# Altium schematic sheet USB.SchDoc
size A; SheetNumber: 2; SheetTotal: 6
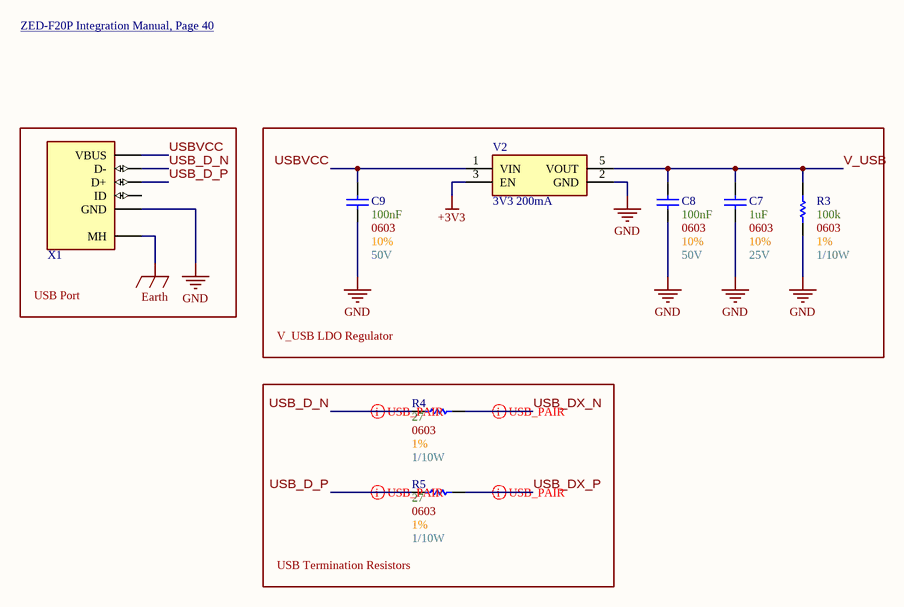
[diagram p0: USB.SchDoc]

## Parts
C7  Max Voltage: 25V  Size Package: 0603  Tolerance: 10%  Capacitance: 1uF  [[Cap] SMD 0603]  (hidden comment: [Cap] 0603 1uF 10% 25V)
C8  Max Voltage: 50V  Size Package: 0603  Tolerance: 10%  Capacitance: 100nF  [[Cap] SMD 0603]  (hidden comment: [Cap] 0603 0.1uF 10% 50V)
C9  Max Voltage: 50V  Size Package: 0603  Tolerance: 10%  Capacitance: 100nF  [[Cap] SMD 0603]  (hidden comment: [Cap] 0603 0.1uF 10% 50V)
R3  Wattage: 1/10W  Tolerance: 1%  Resistance: 100k  Size Package: 0603  [[Res] SMD 0603]  (hidden comment: [100k] SMD 0603 1% 1/10W)
R4  Wattage: 1/10W  Tolerance: 1%  Resistance: 27  Size Package: 0603  [[Res] SMD 0603]  (hidden comment: [27] SMD 0603 1% 1/10W)
R5  Wattage: 1/10W  Tolerance: 1%  Resistance: 27  Size Package: 0603  [[Res] SMD 0603]  (hidden comment: [27] SMD 0603 1% 1/10W)
V2  3V3 200mA  [[Linear] 3V3 0.2A]
X1  [USB] Type-B Mini  [[USB] Type-B Mini]  (value not drawn)

## Blocks framed on the sheet
USB Port: X1
V_USB LDO Regulator: C7-C9 R3 V2
USB Termination Resistors: R4 R5

## Nets
+3V3: V2.3(EN)
Earth: X1.MH
GND: C7.1 C8.1 C9.1 R3.1 V2.2(GND) X1.5(GND)
USB_D_N: R4.1 X1.2(D-)
USB_D_P: R5.1 X1.3(D+)
USB_DX_N: R4.2
USB_DX_P: R5.2
USBVCC: C9.2 V2.1(VIN) X1.1(VBUS)
V_USB: C7.2 C8.2 R3.2 V2.5(VOUT)

Not connected (* = marked no-connect by the designer): X1 4(ID)

## Layout directives
differential pair; differential pair class USB_Pairs: USB_D_N, USB_D_P, USB_DX_N, USB_DX_P

## Notes on the sheet
- ZED-F20P Integration Manual, Page 40 <https://content.u-blox.com/sites/default/files/documents/ZED-F20P_IntegrationManual_UBXDOC-304424225-19671.pdf#page=40>

## Library data of the parts
C7 = [Cap] 0603 1uF 10% 25V: CL10B105KA8NNNC; Supplier 1: DigiKey; Supplier Part Number 1: 1276-1184-1-ND
C8 C9 = [Cap] 0603 0.1uF 10% 50V: CL10B104KB8NNNC; Supplier 1: DigiKey; Supplier Part Number 1: 1276-1000-6-ND
R3 = [100k] SMD 0603 1% 1/10W: RC0603FR-07100KL; Supplier 1: DigiKey; Supplier Part Number 1: 311-100KHRDKR-ND
R4 R5 = [27] SMD 0603 1% 1/10W: MCT06030C2709FP500; Supplier 1: DigiKey; Supplier Part Number 1: 749-1631-1-ND
V2 = [Linear] 3V3 0.2A: TCR2EF33,LM(CT; Supplier 1: DigiKey; Supplier Part Number 1: TCR2EF33LM(CTDKR-ND
X1 = [USB] Type-B Mini: MUSB-05-S-B-SM-A-K-TR; Supplier 1: DigiKey; Supplier Part Number 1: SAM14226CT-ND